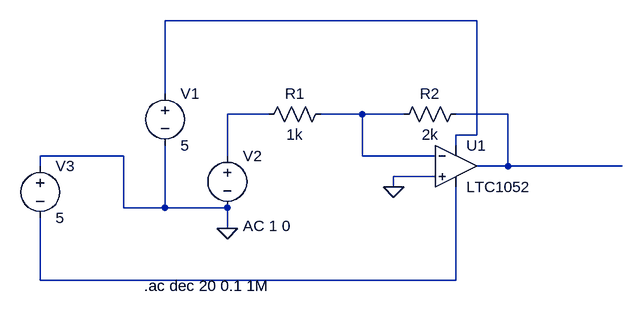
[diagram p0: schematic Invert-Amp.asc]
Invert-Amp.asc, the LTspice schematic file:
Version 4
SHEET 1 880 680
WIRE 336 -96 -144 -96
WIRE -144 16 -144 -96
WIRE 16 48 -48 48
WIRE 160 48 96 48
WIRE 224 48 160 48
WIRE 384 48 304 48
WIRE 336 80 336 -96
WIRE 336 80 304 80
WIRE 304 96 304 80
WIRE -208 112 -336 112
WIRE -48 112 -48 48
WIRE 160 112 160 48
WIRE 272 112 160 112
WIRE -336 128 -336 112
WIRE 384 128 384 48
WIRE 384 128 336 128
WIRE 560 128 384 128
WIRE 272 144 208 144
WIRE 208 160 208 144
WIRE -208 192 -208 112
WIRE -144 192 -144 96
WIRE -144 192 -208 192
WIRE -48 192 -144 192
WIRE -48 224 -48 192
WIRE -336 304 -336 208
WIRE 304 304 304 160
WIRE 304 304 -336 304
FLAG -48 224 0
FLAG 208 160 0
SYMBOL voltage -144 0 R0
WINDOW 123 0 0 Left 2
WINDOW 39 0 0 Left 2
SYMATTR InstName V1
SYMATTR Value 5
SYMBOL voltage -48 96 R0
WINDOW 123 24 124 Left 2
WINDOW 39 0 0 Left 2
SYMATTR Value2 AC 1 0
SYMATTR InstName V2
SYMATTR Value ""
SYMBOL Opamps\\LTC1052 304 64 R0
SYMATTR InstName U1
SYMBOL res 112 32 R90
WINDOW 0 0 56 VBottom 2
WINDOW 3 32 56 VTop 2
SYMATTR InstName R1
SYMATTR Value 1k
SYMBOL res 320 32 R90
WINDOW 0 0 56 VBottom 2
WINDOW 3 32 56 VTop 2
SYMATTR InstName R2
SYMATTR Value 2k
SYMBOL voltage -336 112 R0
WINDOW 123 0 0 Left 2
WINDOW 39 0 0 Left 2
SYMATTR InstName V3
SYMATTR Value 5
TEXT -176 312 Left 2 !.ac dec 20 0.1 1M

The netlist it stands for:
* Invert-Amp.asc
V1 N001 0 5
V2 N002 0 AC 1 0
XU1 0 N003 N001 N005 N004 LTC1052  ; pins In+ In- V+ V- OUT
R1 N003 N002 1k
R2 N004 N003 2k
V3 0 N005 5
.ac dec 20 0.1 1M
.backanno
.end